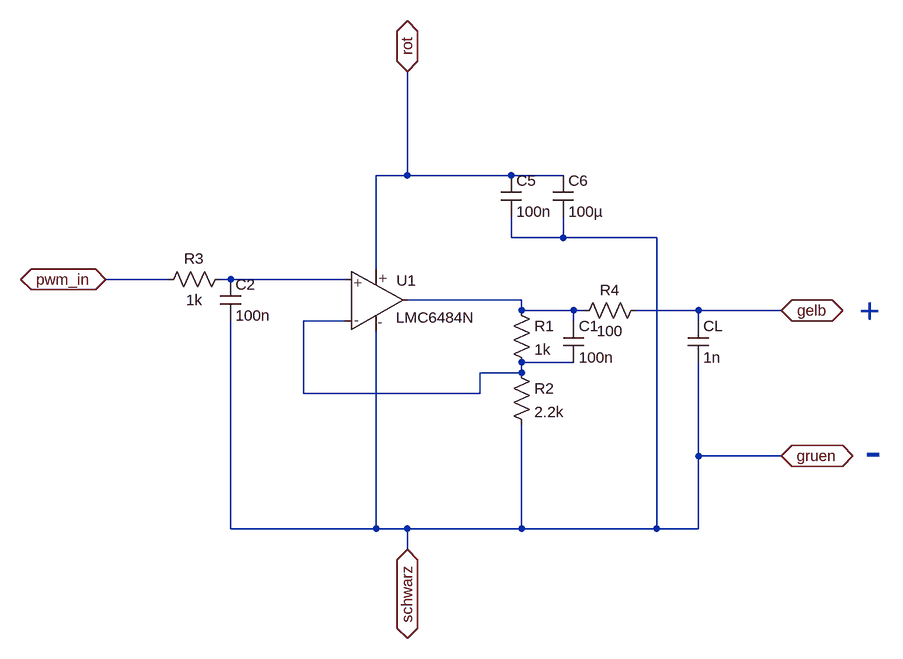
[diagram p0: schematic Levelshifter.asc]
Levelshifter.asc, the LTspice schematic file:
Version 4
SHEET 1 1276 696
WIRE 224 -32 224 -192
WIRE 224 -32 176 -32
WIRE 384 -32 224 -32
WIRE 464 -32 384 -32
WIRE 384 64 384 32
WIRE 464 64 464 32
WIRE 464 64 384 64
WIRE 608 64 464 64
WIRE 176 112 176 -32
WIRE -144 128 -240 128
WIRE -48 128 -64 128
WIRE 128 128 -48 128
WIRE 400 160 224 160
WIRE 400 176 400 160
WIRE 480 176 400 176
WIRE 496 176 480 176
WIRE 672 176 576 176
WIRE 800 176 672 176
WIRE 128 192 64 192
WIRE 480 192 480 176
WIRE 672 192 672 176
WIRE 480 256 400 256
WIRE 400 272 400 256
WIRE 400 272 336 272
WIRE 64 304 64 192
WIRE 336 304 336 272
WIRE 336 304 64 304
WIRE 672 400 672 256
WIRE 800 400 672 400
WIRE -48 512 -48 192
WIRE 176 512 176 208
WIRE 176 512 -48 512
WIRE 224 512 176 512
WIRE 400 512 400 352
WIRE 400 512 224 512
WIRE 608 512 608 64
WIRE 608 512 400 512
WIRE 672 512 672 400
WIRE 672 512 608 512
WIRE 224 544 224 512
FLAG 224 -192 rot
IOPIN 224 -192 BiDir
FLAG 224 544 schwarz
IOPIN 224 544 BiDir
FLAG 800 176 gelb
IOPIN 800 176 BiDir
FLAG 800 400 gruen
IOPIN 800 400 BiDir
FLAG -240 128 pwm_in
IOPIN -240 128 BiDir
SYMBOL res 384 160 R0
SYMATTR InstName R1
SYMATTR Value 1k
SYMBOL res 384 256 R0
SYMATTR InstName R2
SYMATTR Value 2.2k
SYMBOL res -48 112 R90
WINDOW 0 0 56 VBottom 2
WINDOW 3 32 56 VTop 2
SYMATTR InstName R3
SYMATTR Value 1k
SYMBOL res 592 160 R90
WINDOW 0 0 56 VBottom 2
WINDOW 3 32 56 VTop 2
SYMATTR InstName R4
SYMATTR Value 100
SYMBOL cap -64 128 R0
SYMATTR InstName C2
SYMATTR Value 100n
SYMBOL cap 368 -32 R0
SYMATTR InstName C5
SYMATTR Value 100n
SYMBOL cap 448 -32 R0
SYMATTR InstName C6
SYMATTR Value 100µ
SYMBOL cap 464 192 R0
SYMATTR InstName C1
SYMATTR Value 100n
SYMBOL cap 656 192 R0
SYMATTR InstName CL
SYMATTR Value 1n
SYMBOL LMC6484N 160 160 R0
SYMATTR InstName U1
TEXT 920 176 Left 5 ;+
TEXT 928 392 Left 6 ;-

The netlist it stands for:
* Levelshifter.asc
R1 N002 N003 1k
R2 N003 gruen 2.2k
R3 N001 pwm_in 1k
R4 gelb N002 100
C2 N001 gruen 100n
C5 rot gruen 100n
C6 rot gruen 100µ
C1 N002 N003 100n
CL gelb gruen 1n
XU1 N001 N003 rot gruen N002 LMC6484N/NS  ; pins +in -in V+ V- out
* +
* -
.lib LMC6484N.txt
.backanno
.end